# Altium project w32_dmx512_Project.PrjPcb
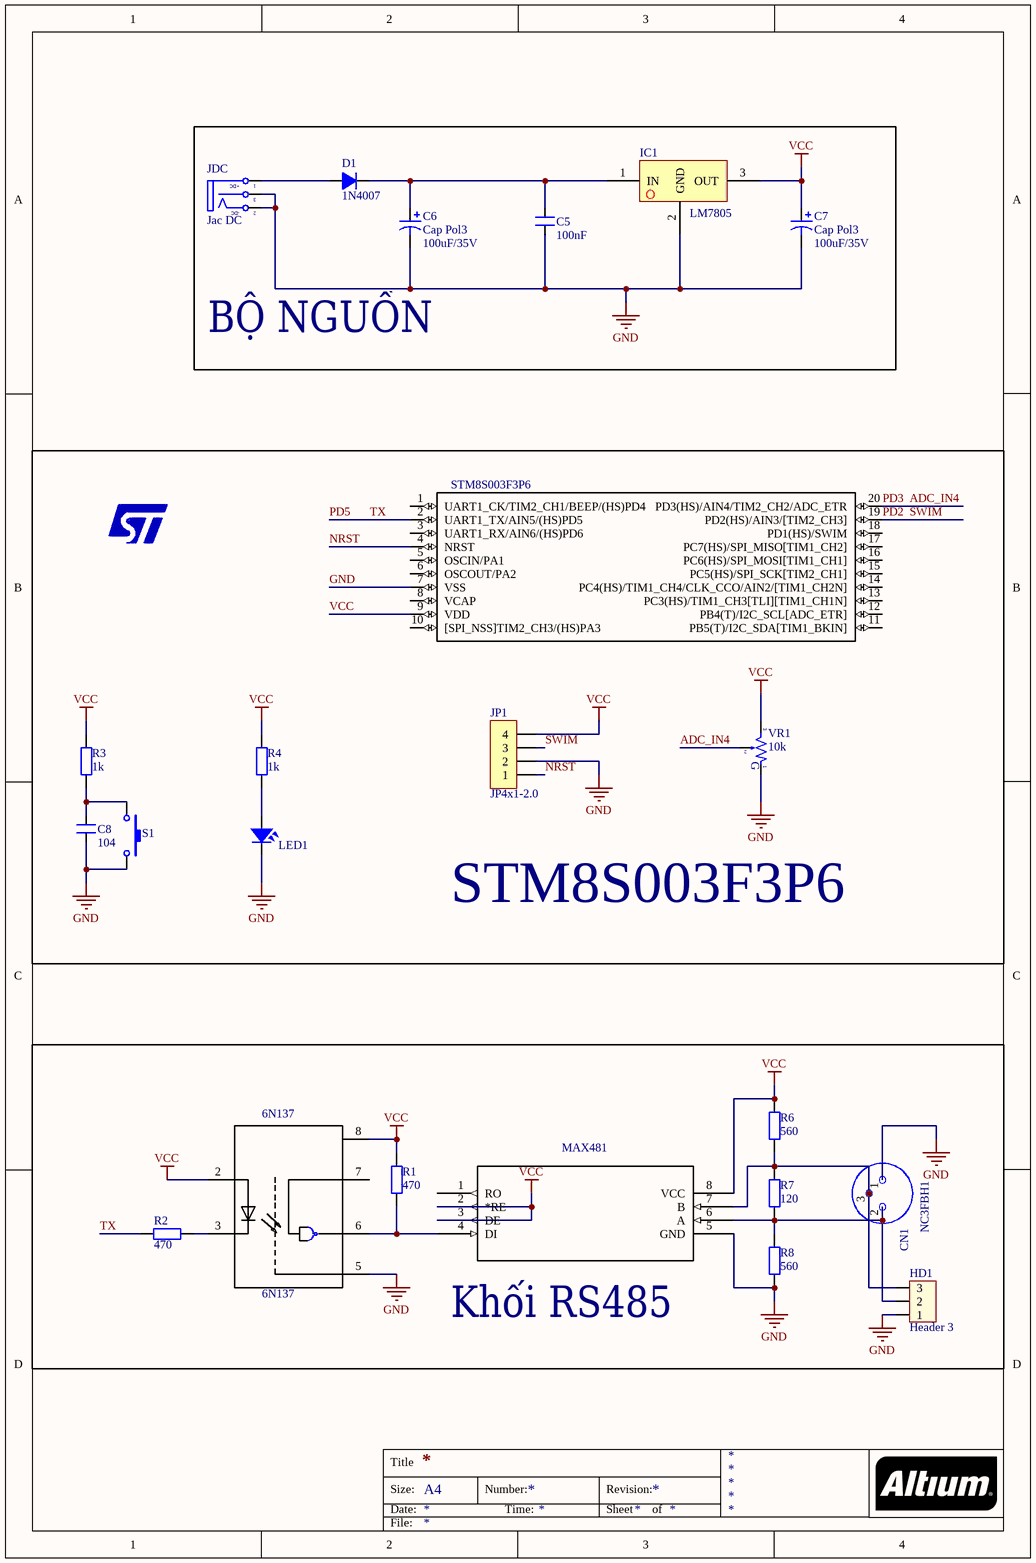
[diagram p0: w32_dmx512_Schematic.SchDoc]
1 sheet, 24 parts. Net scope: global (net labels, ports and power ports of the same name join across sheets).
Board file: w38_dmx512_master_PCB.PcbDoc

## Sheet w32_dmx512_Schematic.SchDoc
size A4 portrait

### Parts
6N137  6N137  [DIP762W50P254L977H451Q8]
C5  value 100nF  [CN150]  (hidden comment: 104)
C6  Cap Pol3  value 100uF/35V  [CP2/5]
C7  Cap Pol3  value 100uF/35V  [CP2/5]
C8  104  [CN150]
CN1  NC3FBH1  [NC3FBH1]
D1  1N4007  [D2A]
HD1  Header 3  [HED3]
IC1  LM7805  [7805]
JDC  Jac DC  [DC-IN]
JP1  JP4x1-2.0  [J4-D1T]
LED1  LED  [LED-RED-0805]  (value not drawn)
M1  STLOGO  [STLOGO-SILVER]  (value not drawn)  (no BOM)
MAX481  MAX481CPA  [21-0043D_8]  (value not drawn)
R1  value 470  [DIEN TRO 1/4 W]  (hidden comment: R0.4W)
R2  value 470  [DIEN TRO 1/4 W]  (hidden comment: R0.4W)
R3  value 1k  [DIEN TRO 1/4 W]  (hidden comment: R0.4W)
R4  value 1k  [DIEN TRO 1/4 W]  (hidden comment: R0.4W)
R6  value 560  [DIEN TRO 1/4 W]  (hidden comment: R0.4W)
R7  value 120  [DIEN TRO 1/4 W]  (hidden comment: R0.4W)
R8  value 560  [DIEN TRO 1/4 W]  (hidden comment: R0.4W)
S1  SW-SMD  [SW-SMD]  (value not drawn)
STM8S003F3P6  STM8S003F3P6  [TSSOP20]  (value not drawn)
VR1  10k  [VR-S1]

### Blocks framed on the sheet
BỘ NGUỒN: C5-C7 D1 IC1 JDC
STM8S003F3P6: C8 JP1 LED1 M1 R3 R4 S1 STM8S003F3P6 VR1
Khối RS485: 6N137 CN1 HD1 MAX481 R1 R2 R6-R8

### Nets
GND: 6N137.5(GND) C5.1 C6.2 C7.2 C8.2 CN1.1 HD1.1 IC1.2(GND) JDC.2(TN) JDC.3(S) JP1.2 LED1.2 MAX481.5(GND) R8.1 S1.2 STM8S003F3P6.7(VSS) VR1.1
VCC: 6N137.2(A) 6N137.8(VCC) C7.1 IC1.3(OUT) JP1.4 MAX481.2(*RE) MAX481.3(DE) MAX481.8(VCC) R1.1 R3.2 R4.2 R6.2 STM8S003F3P6.9(VDD) VR1.3
ADC_IN4: STM8S003F3P6.20(PD3(HS)/AIN4/TIM2_CH2/ADC_ETR) VR1.2  [also labelled PD3]
NRST: JP1.1 STM8S003F3P6.4(NRST)
PD2: JP1.3 STM8S003F3P6.19(PD2(HS)/AIN3/[TIM2_CH3])  [also labelled SWIM]
PD5: R2.1 STM8S003F3P6.2(UART1_TX/AIN5/(HS)PD5)  [also labelled TX]
Net6N137_3: 6N137.3(C) R2.2
Net6N137_6: 6N137.6(VO) MAX481.4(DI) R1.2
NetC5_2: C5.2 C6.1 D1.2(K) IC1.1(IN)
NetC8_1: C8.1 R3.1 S1.1
NetCN1_2: CN1.2 HD1.2 MAX481.6(A) R7.1 R8.2
NetCN1_3: CN1.3 HD1.3 MAX481.7(B) R6.1 R7.2
NetD1_1: D1.1(A) JDC.1(T)
NetLED1_1: LED1.1 R4.1

Not connected (* = marked no-connect by the designer): 6N137 7(VE); MAX481 1(RO); STM8S003F3P6 1(UART1_CK/TIM2_CH1/BEEP/(HS)PD4) 3(UART1_RX/AIN6/(HS)PD6) 5(OSCIN/PA1) 6(OSCOUT/PA2) 8(VCAP) 10([SPI_NSS]TIM2_CH3/(HS)PA3) 11(PB5(T)/I2C_SDA[TIM1_BKIN]) 12(PB4(T)/I2C_SCL[ADC_ETR]) 13(PC3(HS)/TIM1_CH3[TLI][TIM1_CH1N]) 14(PC4(HS)/TIM1_CH4/CLK_CCO/AIN2/[TIM1_CH2N]) 15(PC5(HS)/SPI_SCK[TIM2_CH1]) 16(PC6(HS)/SPI_MOSI[TIM1_CH1]) 17(PC7(HS)/SPI_MISO[TIM1_CH2]) 18(PD1(HS)/SWIM)

### Notes on the sheet
- Title
- Size:
- Date:
- A4
- Number:
- Time:
- Revision:
- Sheet
- of
- File:
- (in symbol DCIN) +DC; -DC
- (in symbol VR-S) G

### Library data of the parts
6N137 = 6N137: High CMR, High Speed TTL Compatible Optocouplers; MF: Vishay Semiconductor; SnapEDA_Link: https://www.snapeda.com/symbols-footprints/6N137/Vishay%20Semiconductor%20Opto%20Division/view-part/?ref=snap; Price: 1.38 USD; MP: 6N137; Package: DIP-8 Broadcom; Availability: Warning; Value: *
C5 C8 = CN1.5: Capacitor Ceramic
  C8: Value: 104
C6 C7 = Cap Pol3: Polarized Capacitor (Surface Mount); VALUE: C?; LatestRevisionDate: 17-Jul-2002; LatestRevisionNote: Re-released for DXP Platform.; PackageReference: C0805; Publisher: Altium Limited
CN1 = NC3FBH1: XLR Receptacle; Female; Gold; Horizontal PCB Mount; 0.996 in.; Ground; MF: Neutrik; Price: 2.36 USD; SnapEDA_Link: https://www.snapeda.com/symbols-footprints/NC3FBH1/Neutrik/view-part/?ref=snap; MP: NC3FBH1; Availability: Good; Package: None; Value: *
D1 = D1A: Diode 1A; Value: 1N4007
HD1 = Hed3: Header 3 (Green); Value: Header 3
JDC = DCIN: Jac DC input; Value: Jac DC
JP1 = JP4x1-2.0: WR-PHD 2.00 mm Socket Header; Manufacturer: W¨¹rth Elektronik eiSos GmbH; partNo: 62000411821; ComponentLink1 Description: Manufacturer; ComponentLink2 Description: Datasheet; NoPins: 04; Created Date: 2 April 2013; ComponentLink1URL: http://www.we-online.com; ComponentLink2URL: http://katalog.we-online.de/em/datasheet/6200xx11821.pdf; Created by: Karrer Zheng
LED1 = LED SMD: Value: LED 3 - 5 ly 2 Colour
MAX481 = MAX481CPA: Single Transmitter/Receiver RS-422/RS-485 8-Pin PDIP N; MF: Maxim Integrated; MP: MAX481CPA; SnapEDA_Link: https://www.snapeda.com/symbols-footprints/MAX481CPA/Maxim%20Integrated/view-part/?ref=snap; Price: 1.85 USD; Availability: Warning; Package: DIP-8 Maxim Integrated; Value: *
R1-R4 R6-R8 = Res 1/4 W: Resistor; Published: 8-Jun-2000; LatestRevisionDate: 17-Jul-2002; LatestRevisionNote: Re-released for DXP Platform.; PackageReference: AXIAL-0.4; Publisher: Altium Limited
S1 = SW-SMD: Switch; Published: 24-Mar-1999; LatestRevisionDate: 17-Jul-2002; LatestRevisionNote: Re-released for DXP Platform.; PackageReference: SPST-2; Publisher: Altium Limited
STM8S003F3P6 = STM8S003F3P6: Mainstream Value line 8-bit MCU with 8 Kbytes Flash, 16 MHz CPU, integrated EEPROM; MF: STMicroelectronics; Package: TSSOP-20 STMicroelectronics; Price: 0.58 USD; MP: STM8S003F3P6; SnapEDA_Link: https://www.snapeda.com/symbols-footprints/STM8S003F3P6/STMicroelectronics/view-part/?ref=snap; Availability: Bad; Value: *
VR1 = VR-S: Var Resistor; Value: Volume 50k